# EAGLE design snare (EAGLE 6.4)
DATABASE: ../partsdb.txt
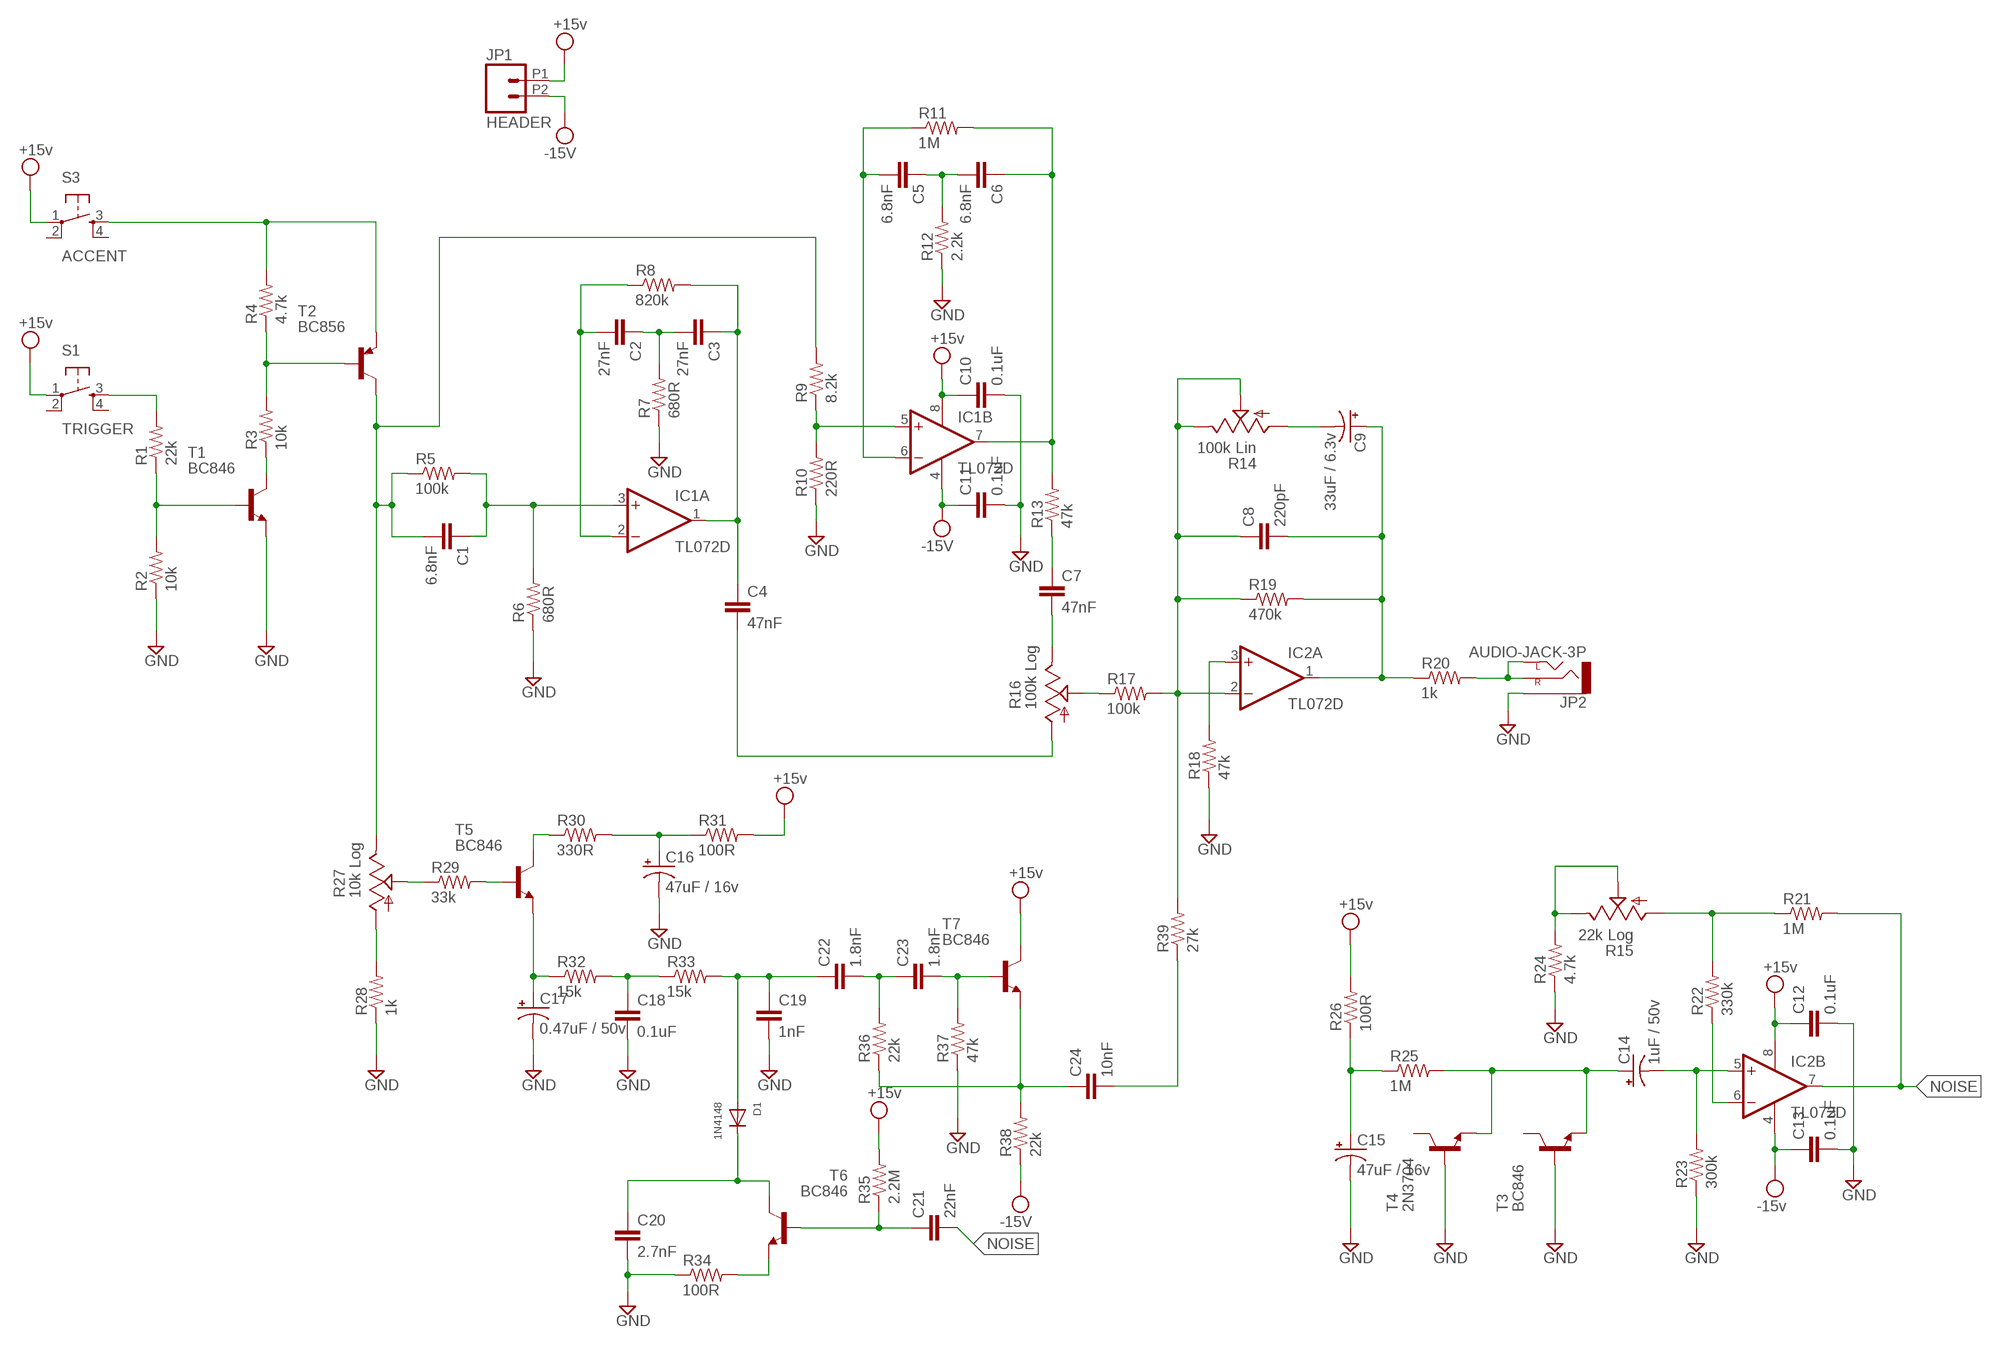
[diagram p0: schematic, sheet 1]

## Parts
C1  6.8nF  CAP0805  [0805]
C2  27nF  CAP0805  [0805]
C3  27nF  CAP0805  [0805]
C4  47nF  CAP0805  [0805]
C5  6.8nF  CAP0805  [0805]
C6  6.8nF  CAP0805  [0805]
C7  47nF  CAP0805  [0805]
C8  220pF  CAP0805  [0805]
C9  33uF / 6.3v  CAP-POLPANASONIC_B-2  [PANASONIC_VS_B-2]
C10  0.1uF  CAP0805  [0805]
C11  0.1uF  CAP0805  [0805]
C12  0.1uF  CAP0805  [0805]
C13  0.1uF  CAP0805  [0805]
C14  1uF / 50v  CAP-POLPANASONIC_B-2  [PANASONIC_VS_B-2]
C15  47uF / 16v  CAP-POLPANASONIC_B-2  [PANASONIC_VS_B-2]
C16  47uF / 16v  CAP-POLPANASONIC_B-2  [PANASONIC_VS_B-2]
C17  0.47uF / 50v  CAP-POLPANASONIC_B-2  [PANASONIC_VS_B-2]
C18  0.1uF  CAP0805  [0805]
C19  1nF  CAP0805  [0805]
C20  2.7nF  CAP0805  [0805]
C21  22nF  CAP0805  [0805]
C22  1.8nF  CAP0805  [0805]
C23  1.8nF  CAP0805  [0805]
C24  10nF  CAP0805  [0805]
D1  1N4148  DIODESOD-323F  [SOD-323F]
IC1  TL072D  [SO08]
IC2  TL072D  [SO08]
JP1  HEADER  [1X02-5.08-SCREWTERM]
JP2  AUDIO-JACK-3P  [CUI-352X-SMT]
R1  22k  RESISTOR0805-RES  [0805]
R2  10k  RESISTOR0805-RES  [0805]
R3  10k  RESISTOR0805-RES  [0805]
R4  4.7k  RESISTOR0805-RES  [0805]
R5  100k  RESISTOR0805-RES  [0805]
R6  680R  RESISTOR0805-RES  [0805]
R7  680R  RESISTOR0805-RES  [0805]
R8  820k  RESISTOR0805-RES  [0805]
R9  8.2k  RESISTOR0805-RES  [0805]
R10  220R  RESISTOR0805-RES  [0805]
R11  1M  RESISTOR0805-RES  [0805]
R12  2.2k  RESISTOR0805-RES  [0805]
R13  47k  RESISTOR0805-RES  [0805]
R14  100k Lin  POTCTS296  [POTENTIOMETER-CTS296]
R15  22k Log  POTPTV09-H  [POTENTIOMETER-PTV09-HORIZ]
R16  100k Log  POTPTV09-V  [POTENTIOMETER-PTV09-VERT]
R17  100k  RESISTOR0805-RES  [0805]
R18  47k  RESISTOR0805-RES  [0805]
R19  470k  RESISTOR0805-RES  [0805]
R20  1k  RESISTOR0805-RES  [0805]
R21  1M  RESISTOR0805-RES  [0805]
R22  330k  RESISTOR0805-RES  [0805]
R23  300k  RESISTOR0805-RES  [0805]
R24  4.7k  RESISTOR0805-RES  [0805]
R25  1M  RESISTOR0805-RES  [0805]
R26  100R  RESISTOR0805-RES  [0805]
R27  10k Log  POTPTV09-H  [POTENTIOMETER-PTV09-HORIZ]
R28  1k  RESISTOR0805-RES  [0805]
R29  33k  RESISTOR0805-RES  [0805]
R30  330R  RESISTOR0805-RES  [0805]
R31  100R  RESISTOR0805-RES  [0805]
R32  15k  RESISTOR0805-RES  [0805]
R33  15k  RESISTOR0805-RES  [0805]
R34  100R  RESISTOR0805-RES  [0805]
R35  2.2M  RESISTOR0805-RES  [0805]
R36  22k  RESISTOR0805-RES  [0805]
R37  47k  RESISTOR0805-RES  [0805]
R38  22k  RESISTOR0805-RES  [0805]
R39  27k  RESISTOR0805-RES  [0805]
S1  TRIGGER  TAC_SWITCHSMD  [TACTILE_SWITCH_SMD]
S3  ACCENT  TAC_SWITCHSMD  [TACTILE_SWITCH_SMD]
T1  BC846  [SOT23]
T2  BC856  BC856B-PNP-SOT23-BEC  [SOT23-BEC]
T3  BC846  [SOT23]
T4  2N3704  [TO92]
T5  BC846  [SOT23]
T6  BC846  [SOT23]
T7  BC846  [SOT23]

## Nets
+15V: C10.1 C12.1 IC1.8(P:V+) IC2.8(P:V+) JP1.P1 R26.2 R31.2 R35.2 S1.1 S3.1 T7.3(C) ; supply symbol labelled +15v
-15V: C11.1 C13.1 IC1.4(P:V-) IC2.4(P:V-) JP1.P2 R38.1 ; supply symbol labelled -15v
GND: C10.2 C11.2 C12.2 C13.2 C15.- C16.- C17.- C18.2 C19.2 C20.2 JP2.1(SLEEVE) R2.1 R6.1 R7.1 R10.1 R12.1 R18.1 R23.1 R24.1 R28.1 R34.1 R37.1 T1.2(E) T3.1(B) T4.1(B)
N$1: R1.2 S1.3
N$2: R1.1 R2.2 T1.1(B)
N$3: R4.2 S3.3 T2.E
N$4: R3.2 R4.1 T2.B
N$5: R3.1 T1.3(C)
N$6: C1.2 R5.1 R9.2 R27.P$3(E) T2.C
N$7: C1.1 IC1.3(A:+IN) R5.2 R6.2
N$8: C2.2 IC1.2(A:-IN) R8.1
N$9: C2.1 C3.2 R7.2
N$10: C3.1 C4.1 IC1.1(A:OUT) R8.2
N$11: IC1.5(B:+IN) R9.1 R10.2
N$12: C5.1 C6.2 R12.2
N$13: C5.2 IC1.6(B:-IN) R11.1
N$14: C6.1 IC1.7(B:OUT) R11.2 R13.2
N$15: C7.2 R16.P$3(E)
N$16: C7.1 R13.1
N$17: R16.P$2(S) R17.1
N$18: C4.2 R16.P$1(A)
N$19: C8.1 IC2.2(A:-IN) R14.P$2(S) R14.P$3(E) R17.2 R19.1 R39.2
N$20: IC2.3(A:+IN) R18.2
N$21: C8.2 C9.+ IC2.1(A:OUT) R19.2 R20.1
N$22: C9.- R14.P$1(A)
N$23: R15.P$1(A) R21.1 R22.2
N$24: JP2.2(LEFT) JP2.3(RIGHT) R20.2
N$25: IC2.6(B:-IN) R22.1
N$26: C14.- IC2.5(B:+IN) R23.2
N$27: R15.P$2(S) R15.P$3(E) R24.2
N$28: C14.+ R25.2 T3.2(E) T4.3(E)
N$29: R27.P$1(A) R28.2
N$30: C15.+ R25.1 R26.1
N$31: R27.P$2(S) R29.1
N$32: R29.2 T5.1(B)
N$33: R30.1 T5.3(C)
N$34: C16.+ R30.2 R31.1
N$35: C17.+ R32.1 T5.2(E)
N$36: C18.1 R32.2 R33.1
N$37: C19.1 C22.1 D1.A R33.2
N$38: C20.1 D1.C T6.3(C)
N$39: R34.2 T6.2(E)
N$40: C21.1 R35.1 T6.1(B)
N$41: C22.2 C23.1 R36.2
N$42: C23.2 R37.2 T7.1(B)
N$43: C24.1 R36.1 R38.2 T7.2(E)
N$44: C24.2 R39.1
NOISE: C21.2 IC2.7(B:OUT) R21.2
Unconnected: S1.2 S1.4 S3.2 S3.4 T3.3(C) T4.2(C)

## Library data of the parts
C1 C5 C6 = SparkFun-Capacitors:CAP: Capacitor Standard 0603 ceramic capacitor, and 0.1" leaded capacitor.; PARTNO: C0805C682K5RACTU
C2 C3 = SparkFun-Capacitors:CAP: Capacitor Standard 0603 ceramic capacitor, and 0.1" leaded capacitor.; PARTNO: CC0805KRX7R9BB273
C4 C7 = SparkFun-Capacitors:CAP: Capacitor Standard 0603 ceramic capacitor, and 0.1" leaded capacitor.; PARTNO: C0805C473K5RACTU
C8 = SparkFun-Capacitors:CAP: Capacitor Standard 0603 ceramic capacitor, and 0.1" leaded capacitor.; PARTNO: CC0805KRX7R9BB221
C9 = Livestream:CAP-POL; PARTNO: EEE-1AA330WAR
C10-C13 C18 = SparkFun-Capacitors:CAP: Capacitor Standard 0603 ceramic capacitor, and 0.1" leaded capacitor.; PARTNO: C0805C104K5RACTU
C14 = Livestream:CAP-POL; PARTNO: EEE-1HA010SR
C15-C17 = Livestream:CAP-POL; PARTNO: EEE-1HAR47AR
C19 = SparkFun-Capacitors:CAP: Capacitor Standard 0603 ceramic capacitor, and 0.1" leaded capacitor.; PARTNO: C0805C102K5RACTU
C20 = SparkFun-Capacitors:CAP: Capacitor Standard 0603 ceramic capacitor, and 0.1" leaded capacitor.; PARTNO: CC0805KRX7R9BB272
C21 = SparkFun-Capacitors:CAP: Capacitor Standard 0603 ceramic capacitor, and 0.1" leaded capacitor.; PARTNO: CL21B223KBANNNC
C22 C23 = SparkFun-Capacitors:CAP: Capacitor Standard 0603 ceramic capacitor, and 0.1" leaded capacitor.; PARTNO: 08055C182KAT2A
C24 = SparkFun-Capacitors:CAP: Capacitor Standard 0603 ceramic capacitor, and 0.1" leaded capacitor.; PARTNO: GRM216R71H103KA01D
D1 = adafruit:DIODE: Diode SMADIODE - SMA Surface Mount Package 20V 1A Schottky Diode Digikey: 641-1014-6-ND DO-1N4148 - Through Hole Small Current Diode SOD-123 20V 1 A (.5mV Vf) Schottky Diode - Digikey: MBRX120TPMSCT-ND SOD-323 10V 570mA (.38mV Vf, 3ns) Schottky Diode - Digikey: ZLLS410CT-ND SOD-523 30V 30mA Schottky Diode (RB751S-40TE61) - Digikey: RB751S-40TE61CT-ND SOT23-R/W - SOT23 Package (R = Solder Paste/Reflow Ovens, W = Hand-Soldering) BAT54Film 40V 300mA - Digikey: 497-7162-1-ND; PARTNO: 1N4148WS
IC1 IC2 = linear:TL072: OP AMP; PARTNO: TL072SG-13
JP1 = Livestream:HEADER
JP2 = Livestream:AUDIO-JACK-3P; PARTNO: SJ-3523-SMT-TR
R1 R36 R38 = SparkFun-Resistors:RESISTOR: Resistor Basic schematic elements and footprints for 0603, 1206, and PTH resistors.; PARTNO: RMCF0805FT22K0
R2 R3 = SparkFun-Resistors:RESISTOR: Resistor Basic schematic elements and footprints for 0603, 1206, and PTH resistors.; PARTNO: RMCF0805FT10K0
R4 R24 = SparkFun-Resistors:RESISTOR: Resistor Basic schematic elements and footprints for 0603, 1206, and PTH resistors.; PARTNO: RMCF0805FT4K70
R5 R17 = SparkFun-Resistors:RESISTOR: Resistor Basic schematic elements and footprints for 0603, 1206, and PTH resistors.; PARTNO: RMCF0805FT100K
R6 R7 = SparkFun-Resistors:RESISTOR: Resistor Basic schematic elements and footprints for 0603, 1206, and PTH resistors.; PARTNO: RMCF0805FT680R
R8 = SparkFun-Resistors:RESISTOR: Resistor Basic schematic elements and footprints for 0603, 1206, and PTH resistors.; PARTNO: RC0805FR-07820KL
R9 = SparkFun-Resistors:RESISTOR: Resistor Basic schematic elements and footprints for 0603, 1206, and PTH resistors.; PARTNO: RMCF0805FT8K20
R10 = SparkFun-Resistors:RESISTOR: Resistor Basic schematic elements and footprints for 0603, 1206, and PTH resistors.; PARTNO: RMCF0805FT220R
R11 R21 R25 = SparkFun-Resistors:RESISTOR: Resistor Basic schematic elements and footprints for 0603, 1206, and PTH resistors.; PARTNO: RMCF0805FT1M00
R12 = SparkFun-Resistors:RESISTOR: Resistor Basic schematic elements and footprints for 0603, 1206, and PTH resistors.; PARTNO: RMCF0805FT2K20
R13 R18 R37 = SparkFun-Resistors:RESISTOR: Resistor Basic schematic elements and footprints for 0603, 1206, and PTH resistors.; PARTNO: RMCF0805FT47K0
R14 = 808:POT; PARTNO: 296UD104B1N
R15 = 808:POT; PARTNO: PTV09A-4025F-A203
R16 = 808:POT; PARTNO: PTV09A-2020F-A104
R19 = SparkFun-Resistors:RESISTOR: Resistor Basic schematic elements and footprints for 0603, 1206, and PTH resistors.; PARTNO: CRCW0805470KFKEA
R20 R28 = SparkFun-Resistors:RESISTOR: Resistor Basic schematic elements and footprints for 0603, 1206, and PTH resistors.; PARTNO: RMCF0805FT1K00
R22 = SparkFun-Resistors:RESISTOR: Resistor Basic schematic elements and footprints for 0603, 1206, and PTH resistors.; PARTNO: RMCF0805FT330K
R23 = SparkFun-Resistors:RESISTOR: Resistor Basic schematic elements and footprints for 0603, 1206, and PTH resistors.; PARTNO: RMCF0805FT300K
R26 R31 R34 = SparkFun-Resistors:RESISTOR: Resistor Basic schematic elements and footprints for 0603, 1206, and PTH resistors.; PARTNO: RMCF0805FT100R
R27 = 808:POT; PARTNO: PTV09A-4020F-A103
R29 = SparkFun-Resistors:RESISTOR: Resistor Basic schematic elements and footprints for 0603, 1206, and PTH resistors.; PARTNO: RMCF0805FT33K0
R30 = SparkFun-Resistors:RESISTOR: Resistor Basic schematic elements and footprints for 0603, 1206, and PTH resistors.; PARTNO: RMCF0805FT330R
R32 R33 = SparkFun-Resistors:RESISTOR: Resistor Basic schematic elements and footprints for 0603, 1206, and PTH resistors.; PARTNO: RMCF0805FT15K0
R35 = SparkFun-Resistors:RESISTOR: Resistor Basic schematic elements and footprints for 0603, 1206, and PTH resistors.; PARTNO: RC0805FR-072M2L
R39 = SparkFun-Resistors:RESISTOR: Resistor Basic schematic elements and footprints for 0603, 1206, and PTH resistors.; PARTNO: RMCF0805FT27K0
S1 S3 = SparkFun-Electromechanical:TAC_SWITCH: Momentary Switch Button commonly used for reset or general input. Spark Fun Electronics SKU : COM-00097 SMT- SWCH-08247; PARTNO: PTS525SM10SMTR LFS; PROD_ID: SWCH-08247
T1 T3 T5-T7 = transistor-neu-to92:BC846: NPN TRANSISTOR; PARTNO: BC846BMTF
T2 = transistor-neu-to92:*-PNP-: PNP Transistror; PARTNO: BC856BMTF
T4 = transistor:2N3704: NPN TRANSISTOR; PARTNO: 2N3704

## Board
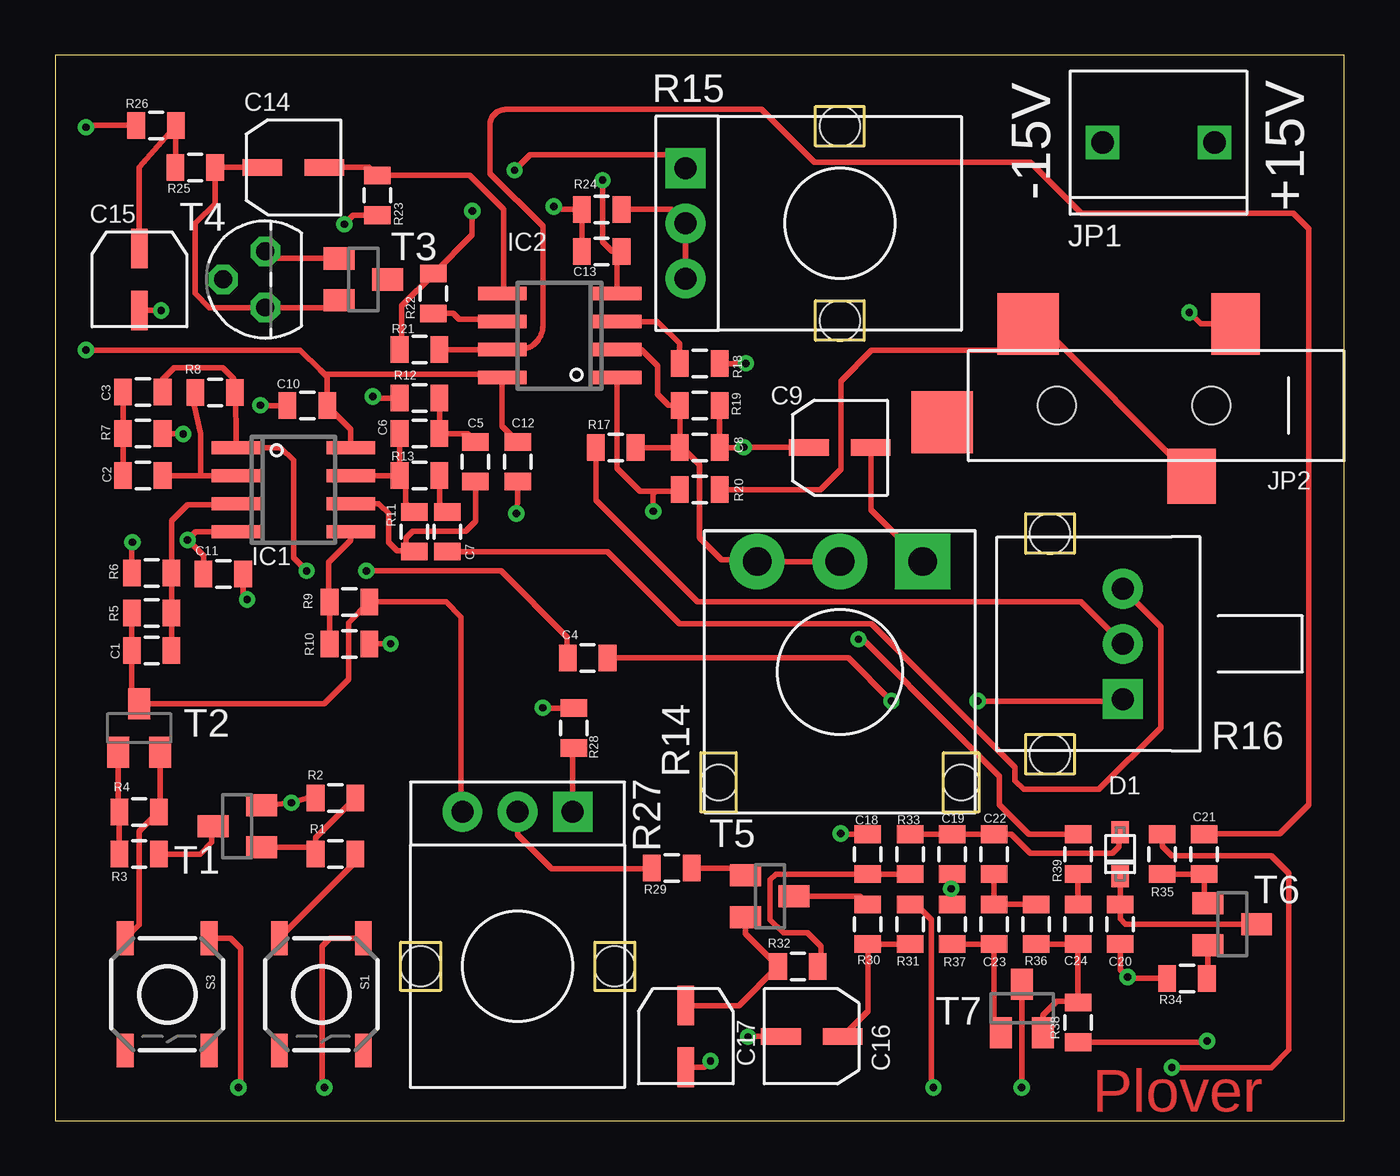
[diagram p1: board, top side]
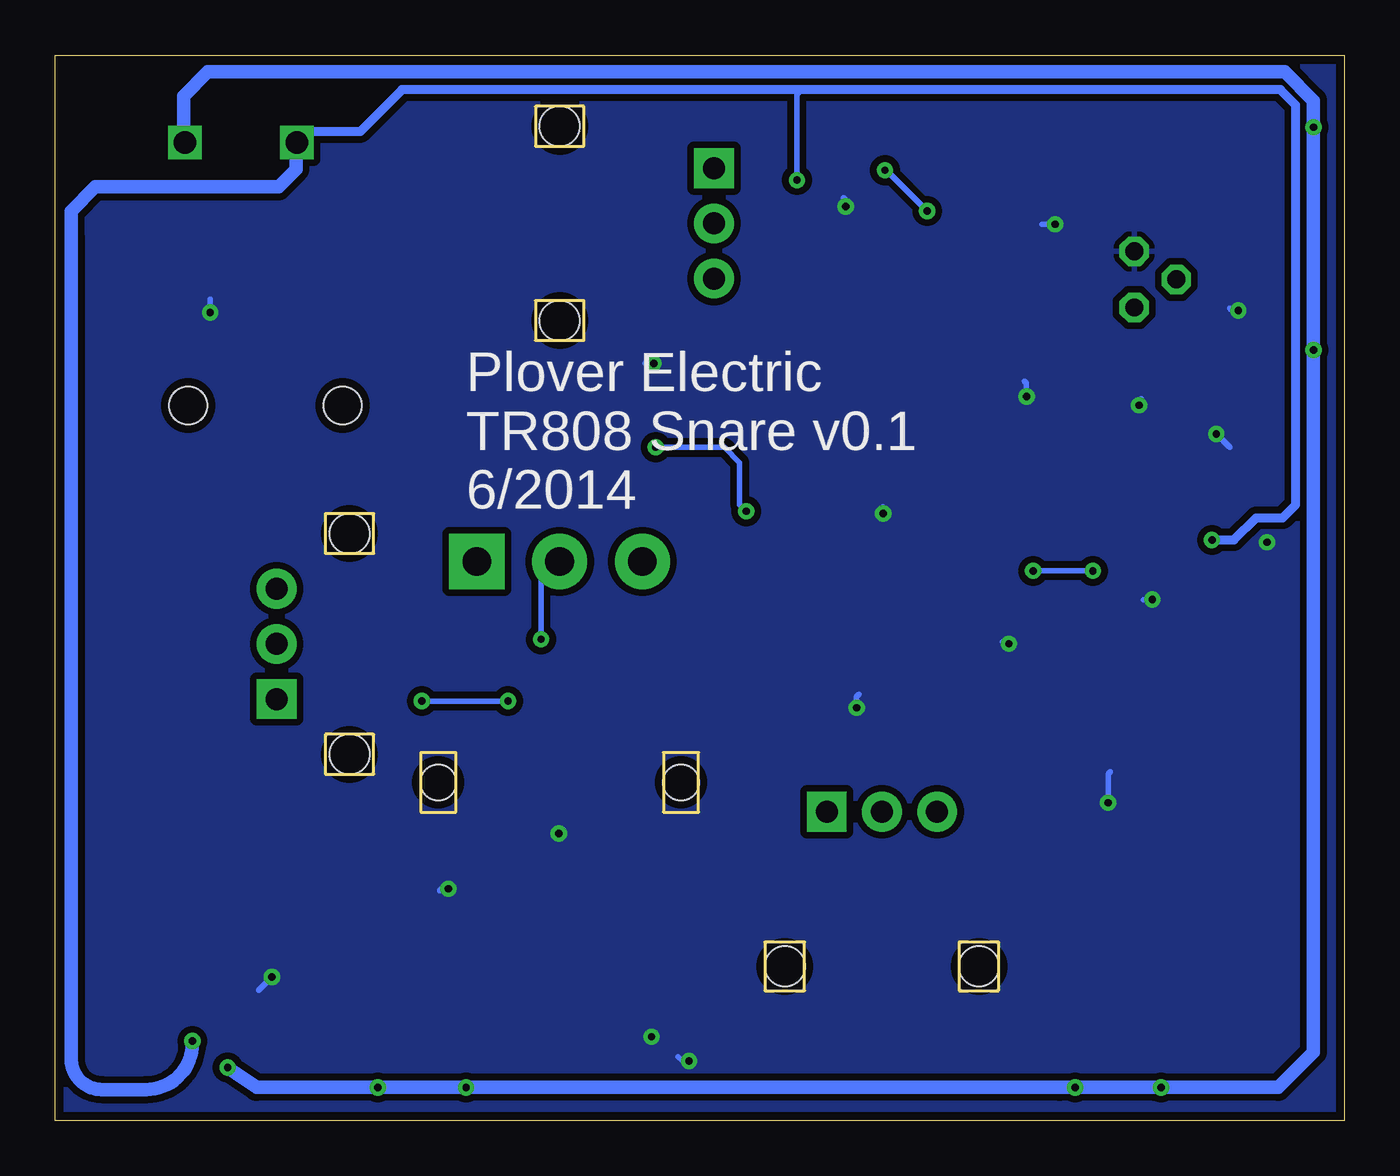
[diagram p2: board, bottom side, seen from below]

Size 58.42 x 48.26 mm. Coordinates in mm from the lower left corner, seen from the top.
Outline: 0,0 58.42,0 58.42,48.26 0,48.26 0,0
Copper layers (1*16): Top 0.035mm / dielectric 1.5mm / Bottom 0.035mm
Design rules "OshPark *": minimum track width 6mil, minimum drill 13mil, track to track 6mil, track to pad 6mil, pad to pad 6mil, via to via 6mil, smd to smd 6mil, copper to edge 15mil, drill to drill 8mil, minimum pad ring 10mil, minimum via ring 8mil, stop-mask expansion 4mil, vias tented up to drill 25mil, thermal gap 10mil

### Footprints (pad centres in the part's own frame; a part is rotated, then mirrored left to right if it is on the bottom)
0805 = smd 0.8 x 1.2: 1 -0.9,0; 2 0.9,0
PANASONIC_VS_B-2 = smd 0.75 x 1.8: + 0,-1.4; - 0,1.4
SOD-323F = smd 1 x 0.8: A -1,0; C 1,0
SO08 = smd 0.6 x 2.2: 1 -1.905,-2.6; 2 -0.635,-2.6; 3 0.635,-2.6; 4 1.905,-2.6; 5 1.905,2.6; 6 0.635,2.6; 7 -0.635,2.6; 8 -1.905,2.6
1X02-5.08-SCREWTERM = drill 1.016 square: P1 -2.54,0; P2 2.54,0
CUI-352X-SMT = smd 2.2 x 2.8: 1 -4.6,-3.7 | smd 2.8 x 2.8: 2 4.8,-3.7; 4 8.7,0.75 | smd 2.2 x 2.5: 3 -2.6,3.2 | hole 1.7: -3.5,0; 3.5,0
POTENTIOMETER-CTS296 = drill 1.3 pad 2.5 square: P$1 -3.75,-5 | drill 1.3 pad 2.5: P$2 0,-5; P$3 3.75,-5 | hole 1.6: -5.5,5; 5.5,5
POTENTIOMETER-PTV09-HORIZ = drill 1 pad 1.8 square: P$1 -2.5,-7 | drill 1 pad 1.8: P$2 0,-7; P$3 2.5,-7 | hole 1.8: -4.4,0; 4.4,0
POTENTIOMETER-PTV09-VERT = drill 1 pad 1.8 square: P$1 -2.5,-3.3 | drill 1 pad 1.8: P$2 0,-3.3; P$3 2.5,-3.3 | hole 1.8: -5,0; 5,0
TACTILE_SWITCH_SMD = smd 1.524 x 0.762: 1 -2.54,1.905; 2 2.54,1.905; 3 -2.54,-1.905; 4 2.54,-1.905
SOT23 = smd 1 x 1.4: 1 -0.95,-1.1; 2 0.95,-1.1; 3 0,1.1
SOT23-BEC = smd 1 x 1.4: B -0.95,-1.1; C 0,1.1; E 0.95,-1.1
TO92 = drill 0.813 octagon: 1 1.27,0; 2 0,1.905; 3 -1.27,0

### Placement (x,y rotation side)
C1  4.38,21.29 180 top
C2  3.98,29.21 0 top
C3  3.98,33.01 180 top
C4  24.13,20.95 0 top
C5  19.05,29.84 270 top
C6  16.51,31.11 0 top
C7  17.78,26.67 270 top
C8  29.21,30.48 0 top
C9  35.56,30.48 270 top
C10  11.43,32.38 180 top
C11  7.62,24.77 0 top
C12  20.95,29.84 270 top
C13  24.77,39.37 180 top
C14  10.79,43.18 270 top
C15  3.81,38.1 180 top
C16  34.29,3.81 90 top
C17  28.57,3.81 180 top
C18  36.83,12.06 90 top
C19  40.64,12.06 270 top
C20  48.26,8.89 270 top
C21  52.07,12.06 90 top
C22  42.55,12.06 270 top
C23  42.55,8.89 270 top
C24  46.35,8.89 90 top
D1  48.26,12.06 270 top
IC1  10.79,28.57 270 top
IC2  22.86,35.56 90 top
JP1  50,44.3 180 top
JP2  48.9,32.38 180 top
R1  12.7,12.06 0 top
R2  12.7,14.61 0 top
R3  3.81,12.06 180 top
R4  3.81,13.97 0 top
R5  4.38,23 0 top
R6  4.38,24.8 0 top
R7  3.98,31.11 180 top
R8  7.25,32.98 0 top
R9  13.34,23.5 0 top
R10  13.34,21.59 180 top
R11  16.27,26.67 90 top
R12  16.51,32.72 0 top
R13  16.51,29.21 180 top
R14  35.56,20.32 180 top
R15  35.56,40.64 270 top
R16  45.09,21.59 90 top
R17  25.4,30.48 0 top
R18  29.21,34.29 180 top
R19  29.21,32.38 0 top
R20  29.21,28.57 0 top
R21  16.51,34.92 0 top
R22  17.14,37.47 90 top
R23  14.61,41.91 90 top
R24  24.77,41.27 0 top
R25  6.35,43.18 0 top
R26  4.58,45.08 180 top
R27  20.95,6.99 180 top
R28  23.5,17.78 270 top
R29  27.94,11.43 0 top
R30  36.83,8.89 270 top
R31  38.73,8.89 90 top
R32  33.66,6.99 0 top
R33  38.73,12.06 90 top
R34  51.29,6.43 0 top
R35  50.16,12.06 90 top
R36  44.45,8.89 90 top
R37  40.64,8.89 270 top
R38  46.35,4.45 90 top
R39  46.35,12.06 90 top
S1  12.06,5.71 270 top
S3  5.08,5.71 270 top
T1  8.26,13.34 90 top
T2  3.81,17.78 0 top
T3  13.97,38.1 270 top
T4  9.53,38.1 90 top
T5  32.38,10.16 270 top
T6  53.34,8.89 270 top
T7  43.81,5.08 0 top

### Tracks (layer width: path | path; a pad name or v marks a point on that pad's centre or on a via)
+15V  (via drill 0.33)
  Top 0.254: C12.1 20.26,31.44 IC2.8 19.45,33.66 19.3,33.8 12.2,33.8 12,34 | T7.3 43.81,1.54 v43.8,1.5 | R31.2 39.01,9.79 39.7,9.1 39.7,1.62 v39.8,1.5 | R35.2 50.16,12.44 50.6,12 55.1,12 55.9,11.2 55.9,3.2 55.1,2.4 v50.6,2.4 | S3.1 7.95,8.26 8.4,7.8 8.4,1.6 v8.3,1.5 | S1.1 12.46,8.26 12.1,7.9 12.1,1.6 v12.2,1.5 | R26.2 1.72,45.08 v1.4,45 | IC1.8 13.39,31.32 C10.1 12.33,33.67 12,34 | 12,34 11.1,34.9 v1.4,34.9
  Bottom 0.254: v43.8,1.5 44,1.42 | v39.8,1.5 40.4,1.52 | 40.4,1.52 | v50.6,2.4 50.47,2.4 50.19,2.12 | v8.3,1.5 8.6,1.5 | v12.2,1.5 12.9,1.5 | v1.4,45 1.4,44 | v1.4,34.9 1.4,34.7
  Bottom 0.61: v1.4,45 1.4,46.2 2.7,47.5 44.3,47.5 51.5,47.5 52.6,46.4 52.6,44.36 JP1.P1 | v1.4,45 1.4,44 | 1.4,44 v1.4,45 | v1.4,45 1.4,44 | 1.4,44 v1.4,34.9 1.4,34.7 1.4,3.1 3,1.5 v8.3,1.5 8.6,1.5 v12.2,1.5 12.9,1.5 v39.8,1.5 v43.8,1.5 49.3,1.5 50.19,2.12 v50.6,2.4
-15V  (via drill 0.33)
  Top 0.254: R38.1 51.34,3.54 52.15,3.54 arc90 v52.2,3.6 | C11.1 6.72,25.58 v6,26.3 6.37,26.67 IC1.4 | IC2.4 25.46,39.16 C13.1 25.23,39.37 24.8,39.8 v24.8,42.6
  Bottom 0.254: v52.2,3.6 52.1,3.6 arc-90 52.2,3.5 | v24.8,42.6 24.8,46.5 24.6,46.7
  Bottom 0.406: v6,26.3 5,26.3 4,27.3 2.8,27.3 2.2,27.9 2.2,46 2.9,46.7 24.6,46.7 42.7,46.7 44.6,44.8 46.96,44.8 JP1.P2
  Bottom 0.61: 52.2,3.5 arc90 54.3,1.4 56.3,1.4 arc90 57.7,2.8 57.7,40.1 57.7,41.2 56.6,42.3 48.3,42.3 47.5,43.1 47.5,44.26 JP1.P2
GND  (via drill 0.33)
  Top 0.254: R6.1 3.48,25.62 v3.5,26.2 | R7.1 v5.8,31.1 | C15.- v4.8,36.7 | T3.1 9.85,39.05 T4.1 | R23.1 13.51,41.01 v13.1,40.6 | v22.6,41.4 22.73,41.27 R24.1 C13.2 | R18.1 v31.29,34.29 v31.3,34.3 | C12.2 20.95,28.05 v20.9,27.5 | R12.1 14.48,32.72 v14.4,32.8 | C10.2 9.31,32.38 v9.3,32.4 | C11.2 8.52,23.78 v8.7,23.6 | R10.1 v15.19,21.59 v15.2,21.6 | R2.1 11.39,14.61 v10.7,14.4 9.69,14.29 T1.2 | C17.- 29.41,2.41 v29.7,2.7 | C16.- v31.41,3.81 v31.4,3.8 | R37.1 40.64,10.46 v40.6,10.5 40.64,10.54 C19.2 | C18.2 35.63,12.96 v35.6,13 | C20.2 48.26,6.84 v48.6,6.5 48.66,6.43 R34.1 | JP2.1 51.91,36.09 v51.4,36.6 | R28.1 22.12,18.68 v22.1,18.7
  Bottom 0.254: v3.5,26.2 3.7,26.2 | v5.8,31.1 5.2,30.5 | v4.8,36.7 5.1,36.7 5.2,36.8 | v13.1,40.6 13.7,40.6 | v22.6,41.4 22.6,41.7 22.7,41.8 | v31.3,34.3 31.7,34.3 | v20.9,27.5 20.9,27.8 21.1,27.6 | v14.4,32.8 14.4,33.4 14.5,33.5 | v9.3,32.4 9.3,32.6 9.2,32.7 | v8.7,23.6 9.1,23.6 | v15.2,21.6 15.4,21.6 15.5,21.7 | v10.7,14.4 10.7,15.7 10.6,15.8 | v29.7,2.7 30,2.7 30.2,2.9 | v31.4,3.8 31.4,3.6 | v40.6,10.5 40.9,10.5 41,10.4 | v35.6,13 35.4,13.2 | v48.6,6.5 49.2,5.9 | v51.4,36.6 51.4,37.2 | v22.1,18.7 22.1,19.2 22,19.3
  pour Bottom (isolate 0.305): 0.2,48 58.2,48 58.2,0.4 0.1,0.4 0.1,47.6
N$1
  Top 0.254: R1.2 13.6,11.7 S1.3
N$2
  Top 0.254: T1.1 11.48,12.38 R1.1 11.8,12.8 R2.2
N$3
  Top 0.254: T2.E 4.76,14.02 R4.2 4.67,13.97 3.8,13.1 3.8,8.88 S3.3
N$4
  Top 0.254: T2.B 2.86,14.02 R4.1 R3.2
N$5
  Top 0.254: R3.1 6.57,12.06 7.1,12.6 7.1,13.28 T1.3
N$6
  Top 0.254: R5.1 C1.2 3.48,19.32 3.9,18.8 3.73,18.8 T2.C 12.18,18.88 13.3,20 13.3,22.56 R9.2 17.7,23.5 18.4,22.8 18.4,14.04 R27.P$3
N$7
  Top 0.254: IC1.3 8.15,27.9 6,27.9 5.28,27.18 R6.2 R5.2 C1.1
N$8
  Top 0.254: IC1.2 6.6,29.21 | 6.6,29.21 5.5,29.21 C2.2 | R8.1 6.3,32.4 6.6,31.1 6.6,29.21
N$9
  Top 0.254: C3.2 R7.2 C2.1
N$10  (via drill 0.33)
  Top 0.254: C3.1 4.88,33.58 5.4,34.1 7.6,34.1 8.1,33.6 8.1,32.84 R8.2 8.2,31.44 IC1.1 10.22,30.48 10.8,29.9 10.8,25.5 v11.4,24.9 | v14.1,24.9 20.2,24.9 23.2,21.9 23.2,20.98 C4.1
  Bottom 0.254: v11.4,24.9 v14.1,24.9
N$11
  Top 0.254: IC1.5 13.39,26.3 12.4,25.3 12.4,23.53 R9.1 R10.2
N$12
  Top 0.254: R12.2 C6.2 18.68,31.11 C5.1
N$13
  Top 0.254: C5.2 19.05,27.15 18.6,26.7 16.2,26.7 15.9,26.4 15.9,25.8 R11.1 16.25,25.8 15.5,25.8 15.1,26.2 15.1,27.5 14.66,27.94 IC1.6
N$14
  Top 0.254: R13.2 15.88,28.95 15.88,27.97 R11.2 | R13.2 C6.1 | R13.2 IC1.7
N$15
  Top 0.254: R16.P$3 50.1,22.38 50.1,17.8 47.3,15 44.3,15 43.9,15 43.5,15.4 43.5,16 37,22.5 36.8,22.5 28.3,22.5 25.03,25.77 C7.2
N$16
  Top 0.254: R13.1 17.41,27.94 C7.1
N$17
  Top 0.254: R17.1 24.5,28.1 29.1,23.5 46.48,23.5 R16.P$2
N$18  (via drill 0.33)
  Top 0.254: C4.2 35.95,20.95 v37.9,19 | v41.8,19 48.3,19 R16.P$1
  Bottom 0.254: v37.9,19 v41.8,19
N$19  (via drill 0.33)
  Top 0.254: IC2.2 26.57,34.92 27.3,34.2 27.3,32.9 27.8,32.4 28.3,32.4 R19.1 C8.1 | C8.1 R17.2 | C8.1 28.42,30.48 29.2,29.7 29.2,26.4 30.2,25.4 31.73,25.4 R14.P$3 R14.P$2 | R39.2 44.13,12.96 42.8,14.3 42.8,15.6 40.8,17.6 36.6,21.8 v36.4,21.8
  Bottom 0.254: v36.4,21.8 36.4,24.48 R14.P$2
N$20
  Top 0.254: IC2.3 27.3,36.2 28.3,35.2 R18.2
N$21  (via drill 0.33)
  Top 0.254: IC2.1 25.46,29.54 26.5,28.5 27.2,28.5 | 27.2,28.5 28.23,28.5 R20.1 | R19.2 C8.2 31.18,30.48 v31.2,30.5 34.14,30.5 C9.+ | v27.1,27.6 27.1,28.4 27.2,28.5
  Bottom 0.254: v31.2,30.5 28.1,30.5 27.4,29.8 27.4,27.9 v27.1,27.6
N$22
  Top 0.254: C9.- 36.96,27.67 R14.P$1
N$23  (via drill 0.33)
  Top 0.254: v20.82,43.05 21.52,43.74 27.96,43.74 R15.P$1 | v18.9,41.2 18.9,40.12 R22.2 17.14,38.34 15.7,36.9 15.7,35.02 R21.1
  Bottom 0.254: v20.82,43.05 20.75,43.05 v18.9,41.2
N$24
  Top 0.254: R20.2 34.67,28.57 35.6,29.5 35.6,33.5 37,34.9 42.91,34.9 JP2.2 44.59,36.09 JP2.3
N$25
  Top 0.254: R22.1 18.04,36.56 18.3,36.3 20.16,36.3 IC2.6
N$26
  Top 0.254: C14.- 14.23,43.18 R23.2 18.79,42.81 20.32,41.27 20.32,37.52 IC2.5
N$27
  Top 0.254: R24.2 27.93,41.27 R15.P$2 R15.P$3
N$28
  Top 0.254: C14.+ R25.2 7.25,41.54 6.35,40.64 6.35,37.47 6.99,36.83 T4.3 12.55,36.83 T3.2
N$29
  Top 0.254: R27.P$1 23.45,16.84 R28.2
N$30
  Top 0.254: C15.+ 3.81,43.18 R26.1 R25.1
N$31
  Top 0.254: R27.P$2 20.95,12.95 22.5,11.4 27.01,11.4 R29.1
N$32
  Top 0.254: R29.2 30.96,11.43 T5.1
N$33
  Top 0.254: T5.3 36.46,10.16 R30.1
N$34
  Top 0.254: R31.1 R30.2 36.83,4.95 C16.+
N$35
  Top 0.254: T5.2 31.29,8.46 R32.1 30.98,5.21 C17.+
N$36
  Top 0.254: R32.2 34.7,7.13 34.7,7.9 34.1,8.5 33,8.5 32.4,9.1 32.4,10.9 32.66,11.16 C18.1 R33.1
N$37
  Top 0.254: R33.2 C19.1 C22.1 43.34,12.96 44.2,12.1 47.9,12.1 48.2,12.4 48.2,13.01 D1.A
N$38
  Top 0.254: D1.C C20.1 48.26,9.14 48.5,8.9 T6.3
N$39
  Top 0.254: T6.2 52.24,6.49 R34.2
N$40
  Top 0.254: R35.1 C21.1 52.07,10.01 T6.1
N$41
  Top 0.254: C22.2 C23.1 R36.2
N$42
  Top 0.254: R37.2 C23.2 42.55,4.3 T7.1
N$43
  Top 0.254: T7.2 44.77,4.76 45.4,5.4 46.3,5.4 R38.2 C24.1 R36.1
N$44
  Top 0.254: C24.2 R39.1
NOISE
  Top 0.254: R21.2 IC2.7 21.02,34.92 arc90 22.1,36 22.1,40.5 19.7,42.9 19.7,45.1 arc-90 20.4,45.8 32,45.8 34.4,43.4 44.2,43.4 46.5,41.1 56.1,41.1 56.4,40.8 56.8,40.4 56.8,14.3 55.5,13 52.1,13 C21.2 52.3,13.2

### Text on the board
Top: Plover
tPlace: -15V | +15V
bPlace: Plover Electric / TR808 Snare v0.1 / 6/2014
bStop: Plover